# Altium schematic sheet Main.SchDoc
size A; SheetNumber: 1; SheetTotal: 6
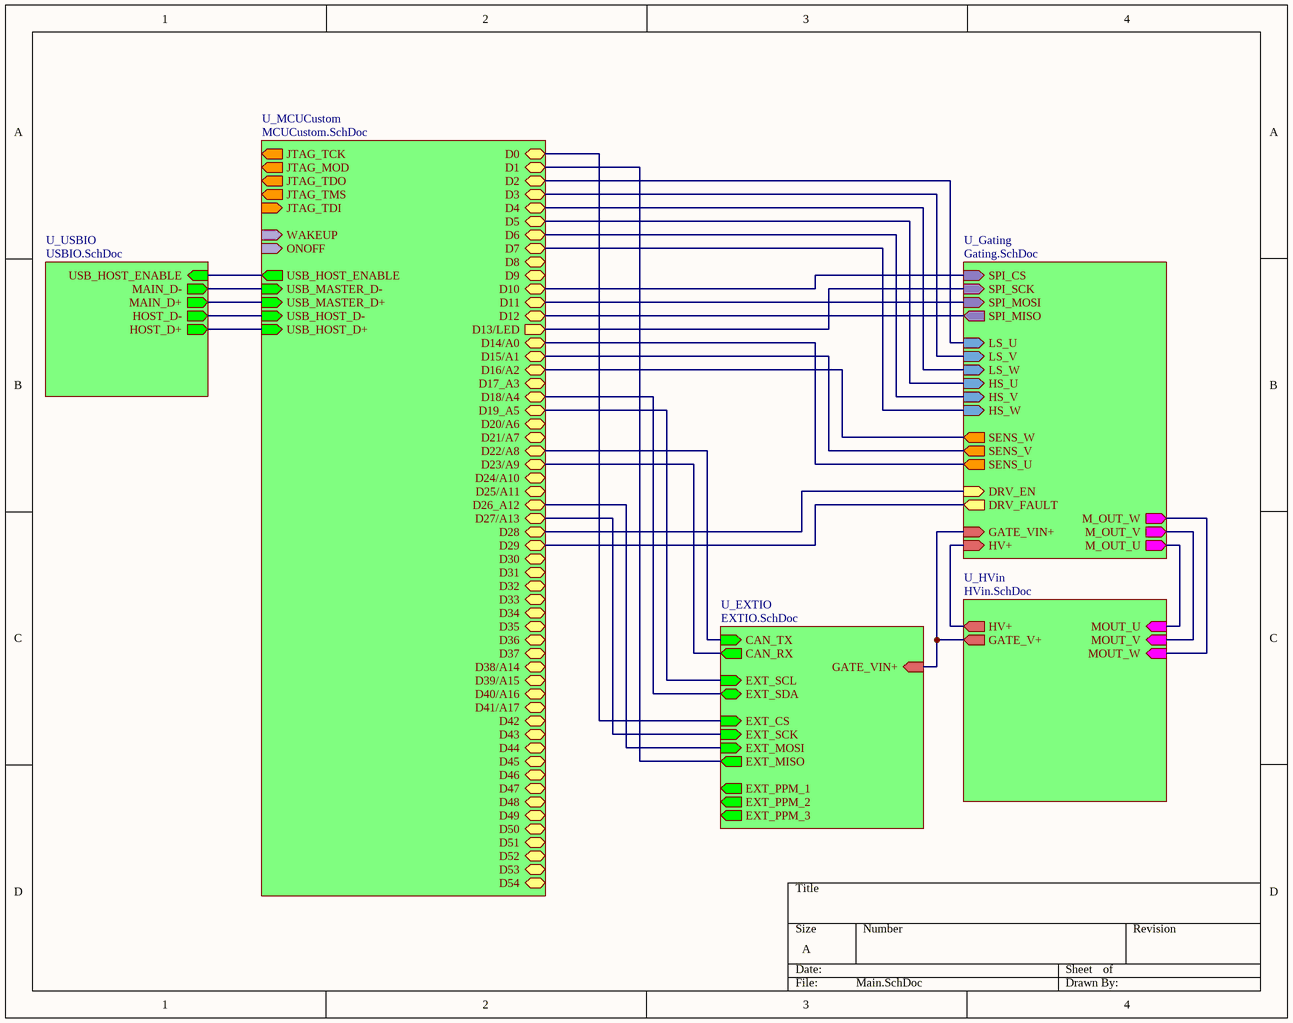
[diagram p0: Main.SchDoc]

## Sub-sheets
U_EXTIO = EXTIO.SchDoc: CAN_RX (out), CAN_TX (in), GATE_VIN+ (in), EXT_PPM_1 (out), EXT_PPM_2 (out), EXT_PPM_3 (out), EXT_SCL (in), EXT_SDA (bidir), EXT_SCK (in), EXT_MOSI (in), EXT_MISO (out), EXT_CS (in)
U_Gating = Gating.SchDoc: DRV_FAULT (out), SPI_CS (in), SPI_SCK (in), SPI_MOSI (in), SPI_MISO (out), GATE_VIN+ (in), LS_U (in), LS_V (in), LS_W (in), HS_U (in), HS_V (in), HS_W (in), SENS_W (out), SENS_V (out), SENS_U (out), DRV_EN (in), M_OUT_U (out), M_OUT_V (out), M_OUT_W (out), HV+ (in)
U_HVin = HVin.SchDoc: HV+ (out), MOUT_U (in), MOUT_V (in), MOUT_W (in), GATE_V+ (out)
U_MCUCustom = MCUCustom.SchDoc: D47 (bidir), D5 (bidir), D33 (bidir), D4 (bidir), D39/A15 (bidir), D38/A14 (bidir), D22/A8 (bidir), D43 (bidir), D46 (bidir), D44 (bidir), D45 (bidir), D19_A5 (bidir), D17_A3 (bidir), D21/A7 (bidir), D27/A13 (bidir), D42 (bidir), D16/A2 (bidir), D18/A4 (bidir), D41/A17 (bidir), D24/A10 (bidir), WAKEUP (in), USB_MASTER_D+ (in), D14/A0 (bidir), D40/A16 (bidir), D20/A6 (bidir), D25/A11 (bidir), ONOFF (in), USB_MASTER_D- (in), D1 (bidir), D15/A1 (bidir), D23/A9 (bidir), USB_HOST_D- (in), USB_HOST_D+ (in), D49 (bidir), D9 (bidir), D8 (bidir), D52 (bidir), D7 (bidir), D31 (bidir), D29 (bidir), D32 (bidir), D36 (bidir), D50 (bidir), D53 (bidir), D48 (bidir), D28 (bidir), D10 (bidir), D13/LED (out), D6 (bidir), D37 (bidir), D35 (bidir), D34 (bidir), D54 (bidir), D30 (bidir), D12 (bidir), D11 (bidir), D51 (bidir), D2 (bidir), JTAG_TCK (out), JTAG_MOD (out), JTAG_TDI (in), D3 (bidir), D0 (bidir), D26_A12 (bidir), JTAG_TDO (out), JTAG_TMS (out), USB_HOST_ENABLE (out)
U_USBIO = USBIO.SchDoc: MAIN_D- (out), MAIN_D+ (out), HOST_D- (out), HOST_D+ (out), USB_HOST_ENABLE (in)

## Nets
(unnamed): sheet U_MCUCustom/D5, sheet U_Gating/HS_U
(unnamed): sheet U_MCUCustom/D4, sheet U_Gating/LS_W
(unnamed): sheet U_MCUCustom/D22/A8, sheet U_EXTIO/CAN_TX
(unnamed): sheet U_MCUCustom/D19_A5, sheet U_EXTIO/EXT_SCL
(unnamed): sheet U_MCUCustom/D27/A13, sheet U_EXTIO/EXT_SCK
(unnamed): sheet U_MCUCustom/D16/A2, sheet U_Gating/SENS_W
(unnamed): sheet U_MCUCustom/D18/A4, sheet U_EXTIO/EXT_SDA
(unnamed): sheet U_MCUCustom/USB_MASTER_D+, sheet U_USBIO/MAIN_D+
(unnamed): sheet U_MCUCustom/D14/A0, sheet U_Gating/SENS_U
(unnamed): sheet U_MCUCustom/USB_MASTER_D-, sheet U_USBIO/MAIN_D-
(unnamed): sheet U_MCUCustom/D1, sheet U_EXTIO/EXT_MISO
(unnamed): sheet U_MCUCustom/D15/A1, sheet U_Gating/SENS_V
(unnamed): sheet U_MCUCustom/D23/A9, sheet U_EXTIO/CAN_RX
(unnamed): sheet U_MCUCustom/USB_HOST_D-, sheet U_USBIO/HOST_D-
(unnamed): sheet U_MCUCustom/USB_HOST_D+, sheet U_USBIO/HOST_D+
(unnamed): sheet U_MCUCustom/D7, sheet U_Gating/HS_W
(unnamed): sheet U_MCUCustom/D29, sheet U_Gating/DRV_FAULT
(unnamed): sheet U_MCUCustom/D28, sheet U_Gating/DRV_EN
(unnamed): sheet U_MCUCustom/D10, sheet U_Gating/SPI_CS
(unnamed): sheet U_MCUCustom/D13/LED, sheet U_Gating/SPI_SCK
(unnamed): sheet U_MCUCustom/D6, sheet U_Gating/HS_V
(unnamed): sheet U_MCUCustom/D12, sheet U_Gating/SPI_MISO
(unnamed): sheet U_MCUCustom/D11, sheet U_Gating/SPI_MOSI
(unnamed): sheet U_MCUCustom/D2, sheet U_Gating/LS_U
(unnamed): sheet U_MCUCustom/D3, sheet U_Gating/LS_V
(unnamed): sheet U_MCUCustom/D0, sheet U_EXTIO/EXT_CS
(unnamed): sheet U_MCUCustom/D26_A12, sheet U_EXTIO/EXT_MOSI
(unnamed): sheet U_MCUCustom/USB_HOST_ENABLE, sheet U_USBIO/USB_HOST_ENABLE
(unnamed): sheet U_HVin/HV+, sheet U_Gating/HV+
(unnamed): sheet U_HVin/MOUT_U, sheet U_Gating/M_OUT_U
(unnamed): sheet U_HVin/MOUT_V, sheet U_Gating/M_OUT_V
(unnamed): sheet U_HVin/MOUT_W, sheet U_Gating/M_OUT_W
(unnamed): sheet U_HVin/GATE_V+, sheet U_Gating/GATE_VIN+, sheet U_EXTIO/GATE_VIN+